# EAGLE design Door Lock_DE_12 (EAGLE 7.2.0)
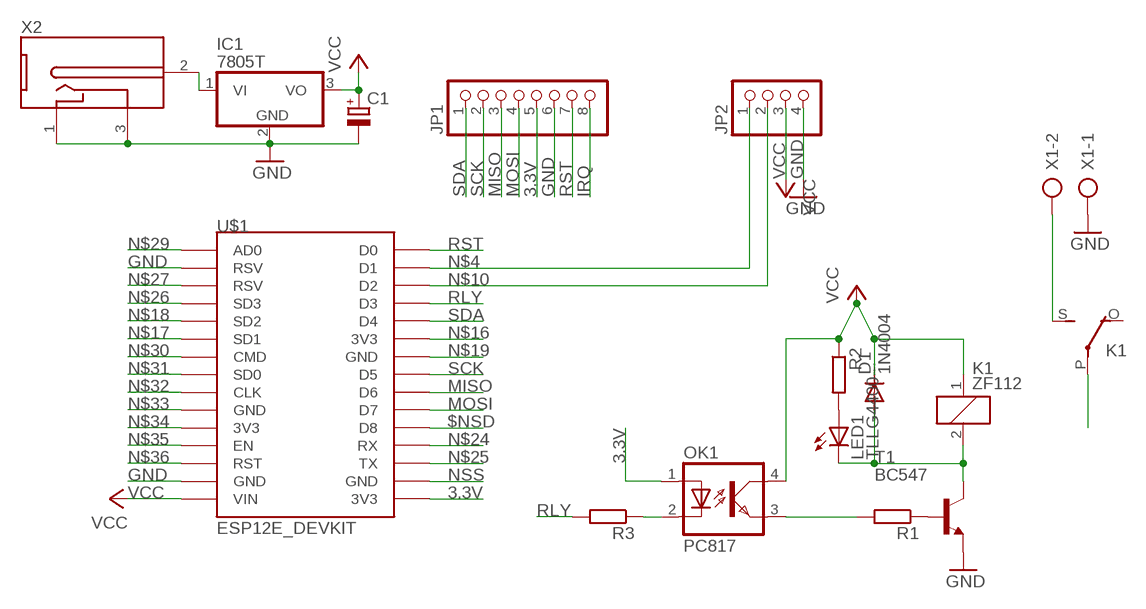
[diagram p0: schematic, sheet 1]

## Parts
C1  CPOL-EUE3.5-8  [E3,5-8]
D1  1N4004  [DO41-10]
IC1  7805T  [TO220H]
JP1  PINHD-1X8  [1X08]
JP2  PINHD-1X4  [1X04]
K1  ZF112  [ZF112]
LED1  TLLG4400  [LED3MM]
OK1  PC817  [DIL04]
R1  R-EU_0204/7  [0204/7]
R2  R-EU_0204/7  [0204/7]
R3  R-EU_0204/7  [0204/7]
T1  BC547  [TO92]
U$1  ESP12E_DEVKIT  [ESP12E_DEVKIT]
X1  AK300/2  [AK300/2]
X2  DC-2.1MM-5MM  [DC-21MM]

## Nets
3.3V: JP1.5 OK1.1(A) U$1.3V3@2(3V3)
$NSD: U$1.D8
GND: C1.- IC1.2(GND) JP1.6 JP2.4 T1.1(E) U$1.GND@1(GND) U$1.RSV@0(RSV) X1.1 X2.1 X2.3
IRQ: JP1.8
MISO: JP1.3 U$1.D6
MOSI: JP1.4 U$1.D7
N$1: LED1.A R2.2
N$2: R1.1 T1.2(B)
N$4: JP2.1 U$1.D1
N$5: IC1.1(VI) X2.2
N$6: K1.S(2:S) X1.2
N$7: D1.A K1.2 LED1.K(C) T1.3(C)
N$8: OK1.3(EMIT) R1.2
N$9: OK1.2(C) R3.1
N$10: JP2.2 U$1.D2
N$16: U$1.3V3@1(3V3)
N$17: U$1.SD1
N$18: U$1.SD2
N$19: U$1.GND@2(GND)
N$24: U$1.RX
N$25: U$1.TX
N$26: U$1.SD3
N$27: U$1.RSV@1(RSV)
N$29: U$1.AD0
N$30: U$1.CMD
N$31: U$1.SD0
N$32: U$1.CLK
N$33: U$1.GND@0(GND)
N$34: U$1.3V3@0(3V3)
N$35: U$1.EN
N$36: U$1.RST
NSS: U$1.GND@3(GND)
RLY: R3.2 U$1.D3
RST: JP1.7 U$1.D0
SCK: JP1.2 U$1.D5
SDA: JP1.1 U$1.D4
VCC: C1.+ D1.C IC1.3(VO) JP2.3 K1.1 K1.P(2:P) OK1.4(COL) R2.1 U$1.VIN
Unconnected: K1.O(2:O)

## Library data of the parts
C1 = resistor:CPOL-EU: POLARIZED CAPACITOR, European symbol
D1 = diode:1N4004: DIODE general purpose rectifier, 1 A
IC1 = linear:78*: Positive VOLTAGE REGULATOR Source: http://cache.national.com/ds/LM/LM78L05.pdf http://www.fairchildsemi.com/ds/LM/LM7805.pdf
JP1 = pinhead:PINHD-1X8: PIN HEADER
JP2 = pinhead:PINHD-1X4: PIN HEADER
K1 = relay:ZF112: RELAY 1 x switch; OC_FARNELL: unknown; OC_NEWARK: unknown
LED1 = led:TLLG4400: Low Current (2mA) LED 3 mm Tinted Diffused Package color GREEN Source: Data sheet <http://www.farnell.com/datasheets/391098.pdf>; MF: VISHAY SEMICONDUCTOR; OC_FARNELL: 1612435
OK1 = optocoupler:PC817: SHARP OPTO COUPLER; MPN: PC817X4J000F; OC_FARNELL: 9707727; OC_NEWARK: 97K7059
R1-R3 = resistor:R-EU_: RESISTOR, European symbol
T1 = transistor:BC547: NPN TRANSISTOR
U$1 = ESP12E_DEVKIT:ESP12E_DEVKIT: ESP12E DEVKIT BOARD
X1 = con-ptr500:AK300/2: CONNECTOR; OC_FARNELL: unknown; OC_NEWARK: unknown
X2 = power-jack:DC: 5mm x 2.1mm jack

## Board
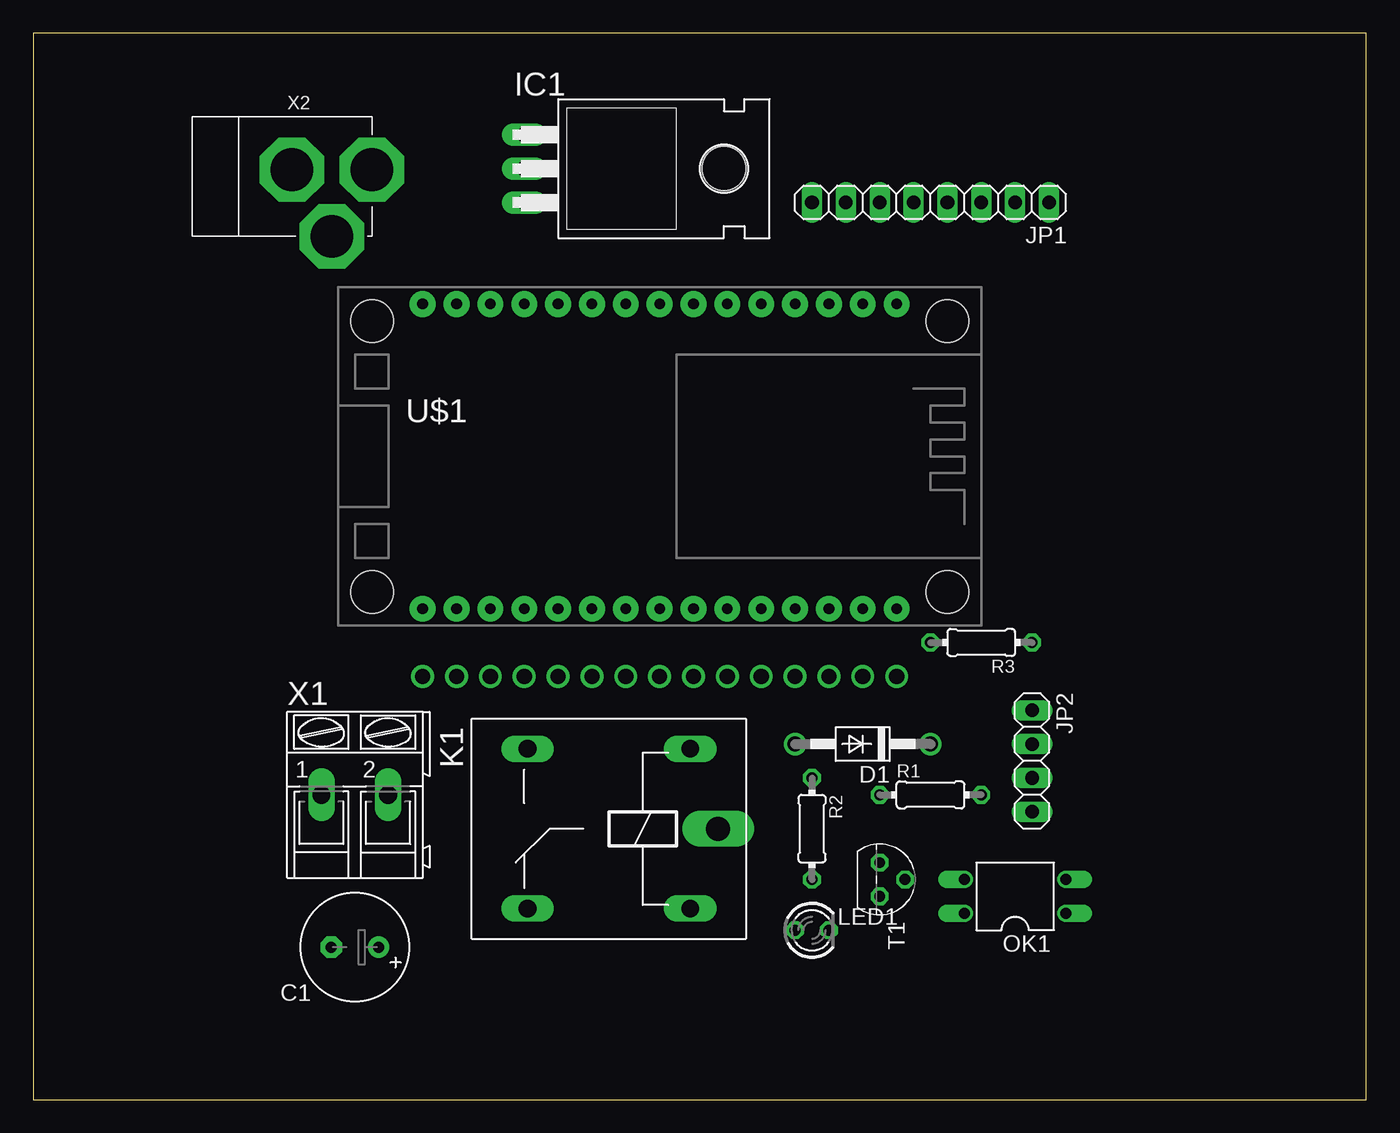
[diagram p1: board, top side]
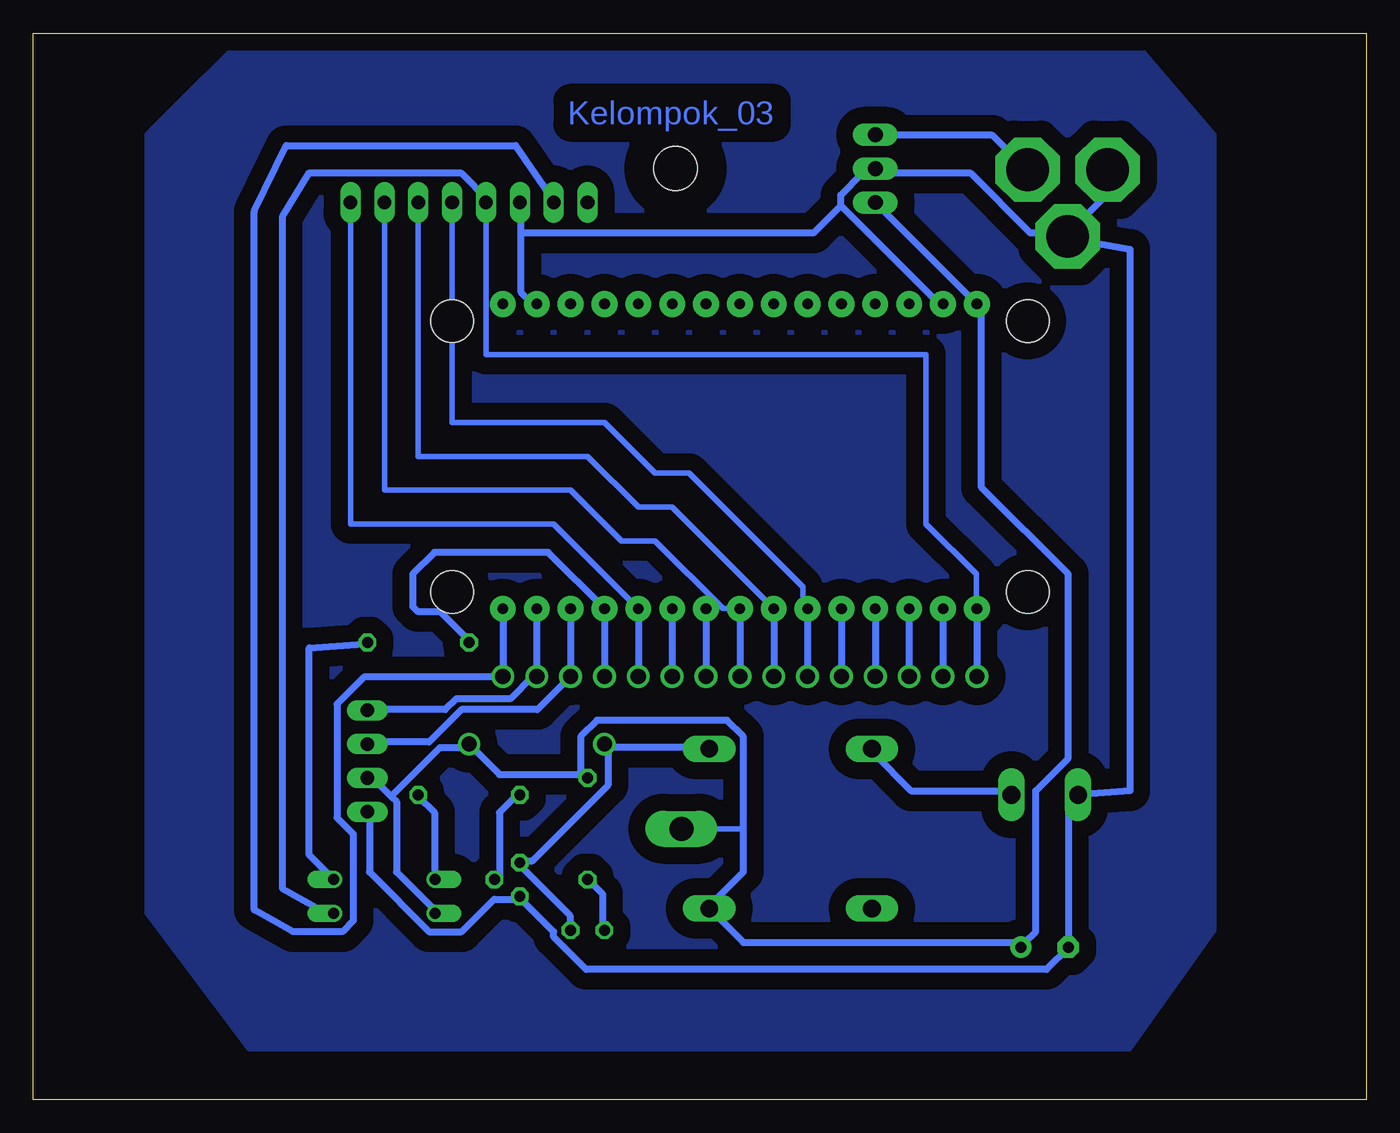
[diagram p2: board, bottom side, seen from below]

Size 100 x 80 mm. Coordinates in mm from the lower left corner, seen from the top.
Outline: 0,0 100,0 100,80 0,80 0,0
Copper layers (1*16): Top 0.035mm / dielectric 1.5mm / Bottom 0.035mm
Design rules "default *": minimum track width 20mil, minimum drill 24mil, track to track 12mil, track to pad 12mil, pad to pad 8mil, via to via 8mil, smd to smd 8mil, copper to edge 40mil, drill to drill 8mil, minimum pad ring 10mil, minimum via ring 8mil, stop-mask expansion 4mil, vias tented up to drill 0mil, thermal gap 10mil

### Footprints (pad centres in the part's own frame; a part is rotated, then mirrored left to right if it is on the bottom)
E3,5-8 = drill 0.813 pad 1.6: + -1.778,0 | drill 0.813 pad 1.6 octagon: - 1.778,0
DO41-10 = drill 1.118: A 5.08,0; C -5.08,0
TO220H = drill 1.118 long: 1 -2.54,-10.16; 2 0,-10.16; 3 2.54,-10.16 | hole 3.302: 0,4.826
1X08 = drill 1.016 long: 1 -8.89,0; 2 -6.35,0; 3 -3.81,0; 4 -1.27,0; 5 1.27,0; 6 3.81,0; 7 6.35,0; 8 8.89,0
1X04 = drill 1.016 long: 1 -3.81,0; 2 -1.27,0; 3 1.27,0; 4 3.81,0
ZF112 = drill 1.321 long: 1 -6.096,5.994; 2 -6.096,-5.994; O 6.096,5.994; S 6.096,-5.994 | drill 1.803 long: P -8.204,0
LED3MM = drill 0.813 octagon: A -1.27,0; K 1.27,0
DIL04 = drill 0.813 offset: 1 -1.27,-3.81; 2 1.27,-3.81; 3 1.27,3.81; 4 -1.27,3.81
0204/7 = drill 0.813 octagon: 1 -3.81,0; 2 3.81,0
TO92 = drill 0.813 octagon: 1 1.27,0; 2 0,1.905; 3 -1.27,0
ESP12E_DEVKIT = drill 0.8 pad 1.93: 3V3@0 -11.43,-7.62; 3V3@1 11.43,5.08; 3V3@2 11.43,-17.78; AD0 -11.43,17.78; CLK -11.43,-2.54; CMD -11.43,2.54; D0 11.43,17.78; D1 11.43,15.24; D2 11.43,12.7; D3 11.43,10.16; D4 11.43,7.62; D5 11.43,0; D6 11.43,-2.54; D7 11.43,-5.08; D8 11.43,-7.62; EN -11.43,-10.16; GND@0 -11.43,-5.08; GND@1 -11.43,-15.24; GND@2 11.43,2.54; GND@3 11.43,-15.24; RST -11.43,-12.7; RSV@0 -11.43,15.24; RSV@1 -11.43,12.7; RX 11.43,-10.16; SD0 -11.43,0; SD1 -11.43,5.08; SD2 -11.43,7.62; SD3 -11.43,10.16; TX 11.43,-12.7; VIN -11.43,-17.78 | hole 3.2: -10.16,21.59; 10.16,21.59; 10.16,-21.59; -10.16,-21.59
AK300/2 = drill 1.321 long: 1 -2.515,0; 2 2.489,0
DC-21MM = drill 3.2 pad 4.826 octagon: 1 -5.08,-3.353; 2 -0.076,-6.35; 3 -0.076,-0.356

### Placement (x,y rotation side)
C1  24.13,11.43 180 top
D1  62.23,26.67 180 top
IC1  46.99,69.85 270 top
JP1  67.31,67.31 180 top
JP2  74.93,25.4 270 top
K1  43.18,20.32 180 top
LED1  58.42,12.7 0 top
OK1  73.66,15.24 90 top
R1  67.31,22.86 0 top
R2  58.42,20.32 270 top
R3  71.12,34.29 180 top
T1  63.5,16.51 270 top
U$1  46.99,48.26 270 top
X1  24.13,22.86 0 top
X2  19.05,69.85 90 top

### Tracks (layer width: path | path; a pad name or v marks a point on that pad's centre or on a via)
3.3V  (via drill 1.14)
  Bottom 0.406: 29.26,36.98 29.26,39.42 33.02,43.18 33.02,55.88 66.04,55.88 JP1.5
  Bottom 0.508: v29.21,31.75 U$1.3V3@2 29.26,36.98 | OK1.1 77.62,14.22 78.44,14.22 81.33,15.85 81.33,66.24 79.35,69.49 67.87,69.49 65.84,67.46 JP1.5 65.84,67.06
$NSD  (via drill 1.14)
  Bottom 0.508: U$1.D8 v39.37,31.75
GND
  Bottom 0.508: 63.4,65.02 63.4,60.55 62.59,59.74 U$1.RSV@0 | 63.4,65.02 63.4,67.06 JP1.6 | 39.42,67.06 39.42,67.87 37.8,69.49 36.98,69.49 IC1.2 36.58,69.49 29.67,69.49 25.2,65.02 22.76,65.02 X2.1 | 39.42,67.06 32.11,59.74 U$1.GND@1 | 63.4,65.02 41.45,65.02 39.42,67.06 | JP2.4 74.78,21.54 74.78,17.07 70.31,12.6 67.87,12.6 65.43,15.04 63.8,15.04 T1.1 63.4,15.04 60.96,12.6 60.96,12.19 58.52,9.75 23.98,9.75 22.35,11.38 C1.- 22.35,22.35 21.95,22.76 X1.1 17.73,23.16 17.73,63.8 22.35,64.62 X2.1 | X2.3 19.51,69.49 19.51,67.87 22.35,65.02 X2.1
MISO  (via drill 1.14)
  Bottom 0.406: 44.7,36.98 44.7,37.08 52.07,44.45 54.61,44.45 58.42,48.26 71.12,48.26 JP1.3
  Bottom 0.508: v44.45,31.75 U$1.D6 44.7,36.98
MOSI  (via drill 1.14)
  Bottom 0.406: 42.27,36.98 42.27,38.46 50.8,46.99 53.34,46.99 57.15,50.8 68.58,50.8 JP1.4
  Bottom 0.508: v41.91,31.75 U$1.D7 42.27,36.98 | 68.68,67.06 JP1.4
N$1
  Bottom 0.508: LED1.A 57.3,13.01 57.3,15.44 58.12,16.26 R2.2
N$2
  Bottom 0.508: T1.2 65.02,16.66 65.02,21.54 63.8,22.76 R1.1
N$3
  pour Bottom (isolate 1.27): 19.05,81.28 82.55,81.28 91.44,72.39 91.44,13.97 83.82,3.81 17.78,3.81 11.43,12.7 11.43,72.39
N$4  (via drill 1.14)
  Bottom 0.508: U$1.D1 v62.23,31.75 62.59,31.7 64.21,30.07 68.28,30.07 69.09,29.26 74.78,29.26 JP2.1
N$5
  Bottom 0.508: IC1.1 36.58,72.34 28.04,72.34 25.6,69.9 X2.2
N$6
  Bottom 0.508: X1.2 26.82,23.16 34.14,23.16 36.98,26.01 K1.S
N$7
  Bottom 0.508: LED1.K 59.74,13.01 59.74,13.82 63.4,17.48 T1.3 63.4,17.88 62.59,17.88 56.9,23.57 56.9,26.42 | 56.9,26.42 49.58,26.42 K1.2 | 56.9,26.42 D1.A
N$8
  Bottom 0.508: OK1.3 69.9,16.66 69.9,21.54 71.12,22.76 R1.2
N$9
  Bottom 0.508: OK1.2 79.3,18.34 79.3,33.88 75.18,34.19 R3.1
N$10  (via drill 1.14)
  Bottom 0.508: U$1.D2 v59.69,31.75 62.18,29.26 67.87,29.26 70.31,26.82 74.78,26.82 JP2.2
N$16  (via drill 1.14)
  Bottom 0.508: U$1.3V3@1 v52.07,31.75
N$19  (via drill 1.14)
  Bottom 0.508: U$1.GND@2 v49.53,31.75
N$24  (via drill 1.14)
  Bottom 0.508: U$1.RX v36.83,31.75
N$25  (via drill 1.14)
  Bottom 0.508: U$1.TX v34.29,31.75
NSS  (via drill 1.14)
  Bottom 0.508: U$1.GND@3 v31.75,31.75
RLY  (via drill 1.14)
  Bottom 0.508: v57.15,31.75 U$1.D3 61.37,41.05 69.9,41.05 71.53,39.42 71.53,36.98 71.17,36.63 69.49,36.63 67.46,34.59 R3.2
RST  (via drill 1.14)
  Bottom 0.508: U$1.D0 v64.77,31.75 65.02,31.7 75.18,31.7 77.22,29.67 77.22,21.13 76,19.91 76,13.41 76.81,12.6 80.52,12.6 83.41,14.22 83.41,66.65 81.03,71.58 63.8,71.58 60.96,67.46 JP1.7
SCK  (via drill 1.14)
  Bottom 0.406: U$1.D5 48.26,36.83 53.34,41.91 55.88,41.91 59.69,45.72 73.66,45.72 JP1.2
  Bottom 0.508: U$1.D5 v46.99,31.75
SDA  (via drill 1.14)
  Bottom 0.406: 54.86,36.98 54.86,37.08 60.96,43.18 76.2,43.18 JP1.1
  Bottom 0.508: v54.61,31.75 U$1.D4 54.86,36.98 | 76,67.06 JP1.1
VCC
  Bottom 0.406: K1.P 46.74,20.32
  Bottom 0.508: 58.93,24.38 65.02,24.38 D1.C 67.46,26.42 69.49,26.42 73.15,22.76 | 58.93,24.38 58.52,24.38 R2.1 58.93,24.38 | 73.15,22.76 74.78,24.38 JP2.3 | 73.15,22.76 72.75,22.35 72.75,17.07 69.9,14.22 OK1.4 | IC1.3 U$1.VIN 28.85,59.33 28.85,45.92 22.35,39.42 22.35,25.6 24.79,23.16 24.79,12.6 25.6,11.79 C1.+ 26.01,11.79 46.74,11.79 K1.1 49.17,14.63 46.74,17.07 46.74,20.32 46.74,27.23 47.95,28.45 57.71,28.45 58.93,27.23 58.93,24.38

### Text on the board
Bottom: Kelompok_03